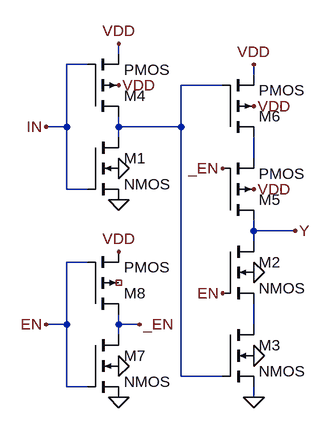
[diagram p0: schematic Draft4.asc]
Draft4.asc, the LTspice schematic file:
Version 4
SHEET 1 880 680
WIRE 208 -144 208 -160
WIRE 160 -128 128 -128
WIRE 416 -112 416 -128
WIRE 368 -96 304 -96
WIRE 128 -32 128 -128
WIRE 128 -32 96 -32
WIRE 208 -32 208 -48
WIRE 304 -32 304 -96
WIRE 304 -32 208 -32
WIRE 208 -16 208 -32
WIRE 416 16 416 -16
WIRE 128 64 128 -32
WIRE 160 64 128 64
WIRE 416 128 416 112
WIRE 480 128 416 128
WIRE 416 144 416 128
WIRE 160 176 128 176
WIRE 128 272 128 176
WIRE 128 272 96 272
WIRE 208 272 208 256
WIRE 240 272 208 272
WIRE 416 272 416 240
WIRE 208 288 208 272
WIRE 304 352 304 -32
WIRE 368 352 304 352
WIRE 128 368 128 272
WIRE 160 368 128 368
WIRE 416 384 416 368
FLAG 416 384 0
FLAG 416 320 0
FLAG 416 192 0
FLAG 208 32 0
FLAG 208 80 0
FLAG 208 384 0
FLAG 208 336 0
FLAG 96 272 EN
FLAG 368 224 EN
FLAG 240 272 _EN
FLAG 368 32 _EN
FLAG 208 160 VDD
FLAG 208 -160 VDD
FLAG 208 -96 VDD
FLAG 416 -64 VDD
FLAG 416 -128 VDD
FLAG 416 64 VDD
FLAG 96 -32 IN
FLAG 480 128 Y
SYMBOL nmos4 160 -16 R0
SYMATTR InstName M1
SYMBOL nmos4 368 144 R0
SYMATTR InstName M2
SYMBOL nmos4 368 272 R0
SYMATTR InstName M3
SYMBOL pmos4 160 -48 M180
SYMATTR InstName M4
SYMBOL pmos4 368 112 M180
SYMATTR InstName M5
SYMBOL pmos4 368 -16 M180
SYMATTR InstName M6
SYMBOL nmos4 160 288 R0
SYMATTR InstName M7
SYMBOL pmos4 160 256 M180
SYMATTR InstName M8

The netlist it stands for:
* Draft4.asc
M1 N001 IN 0 0 NMOS
M2 Y EN N003 0 NMOS
M3 N003 N001 0 0 NMOS
M4 N001 IN VDD VDD PMOS
M5 Y _EN N002 VDD PMOS
M6 N002 N001 VDD VDD PMOS
M7 _EN EN 0 0 NMOS
M8 _EN EN VDD NC_01 PMOS
.model NMOS NMOS
.model PMOS PMOS
.lib standard.mos
.backanno
.end